# Altium schematic sheet fat51ud.SchDoc
size A3
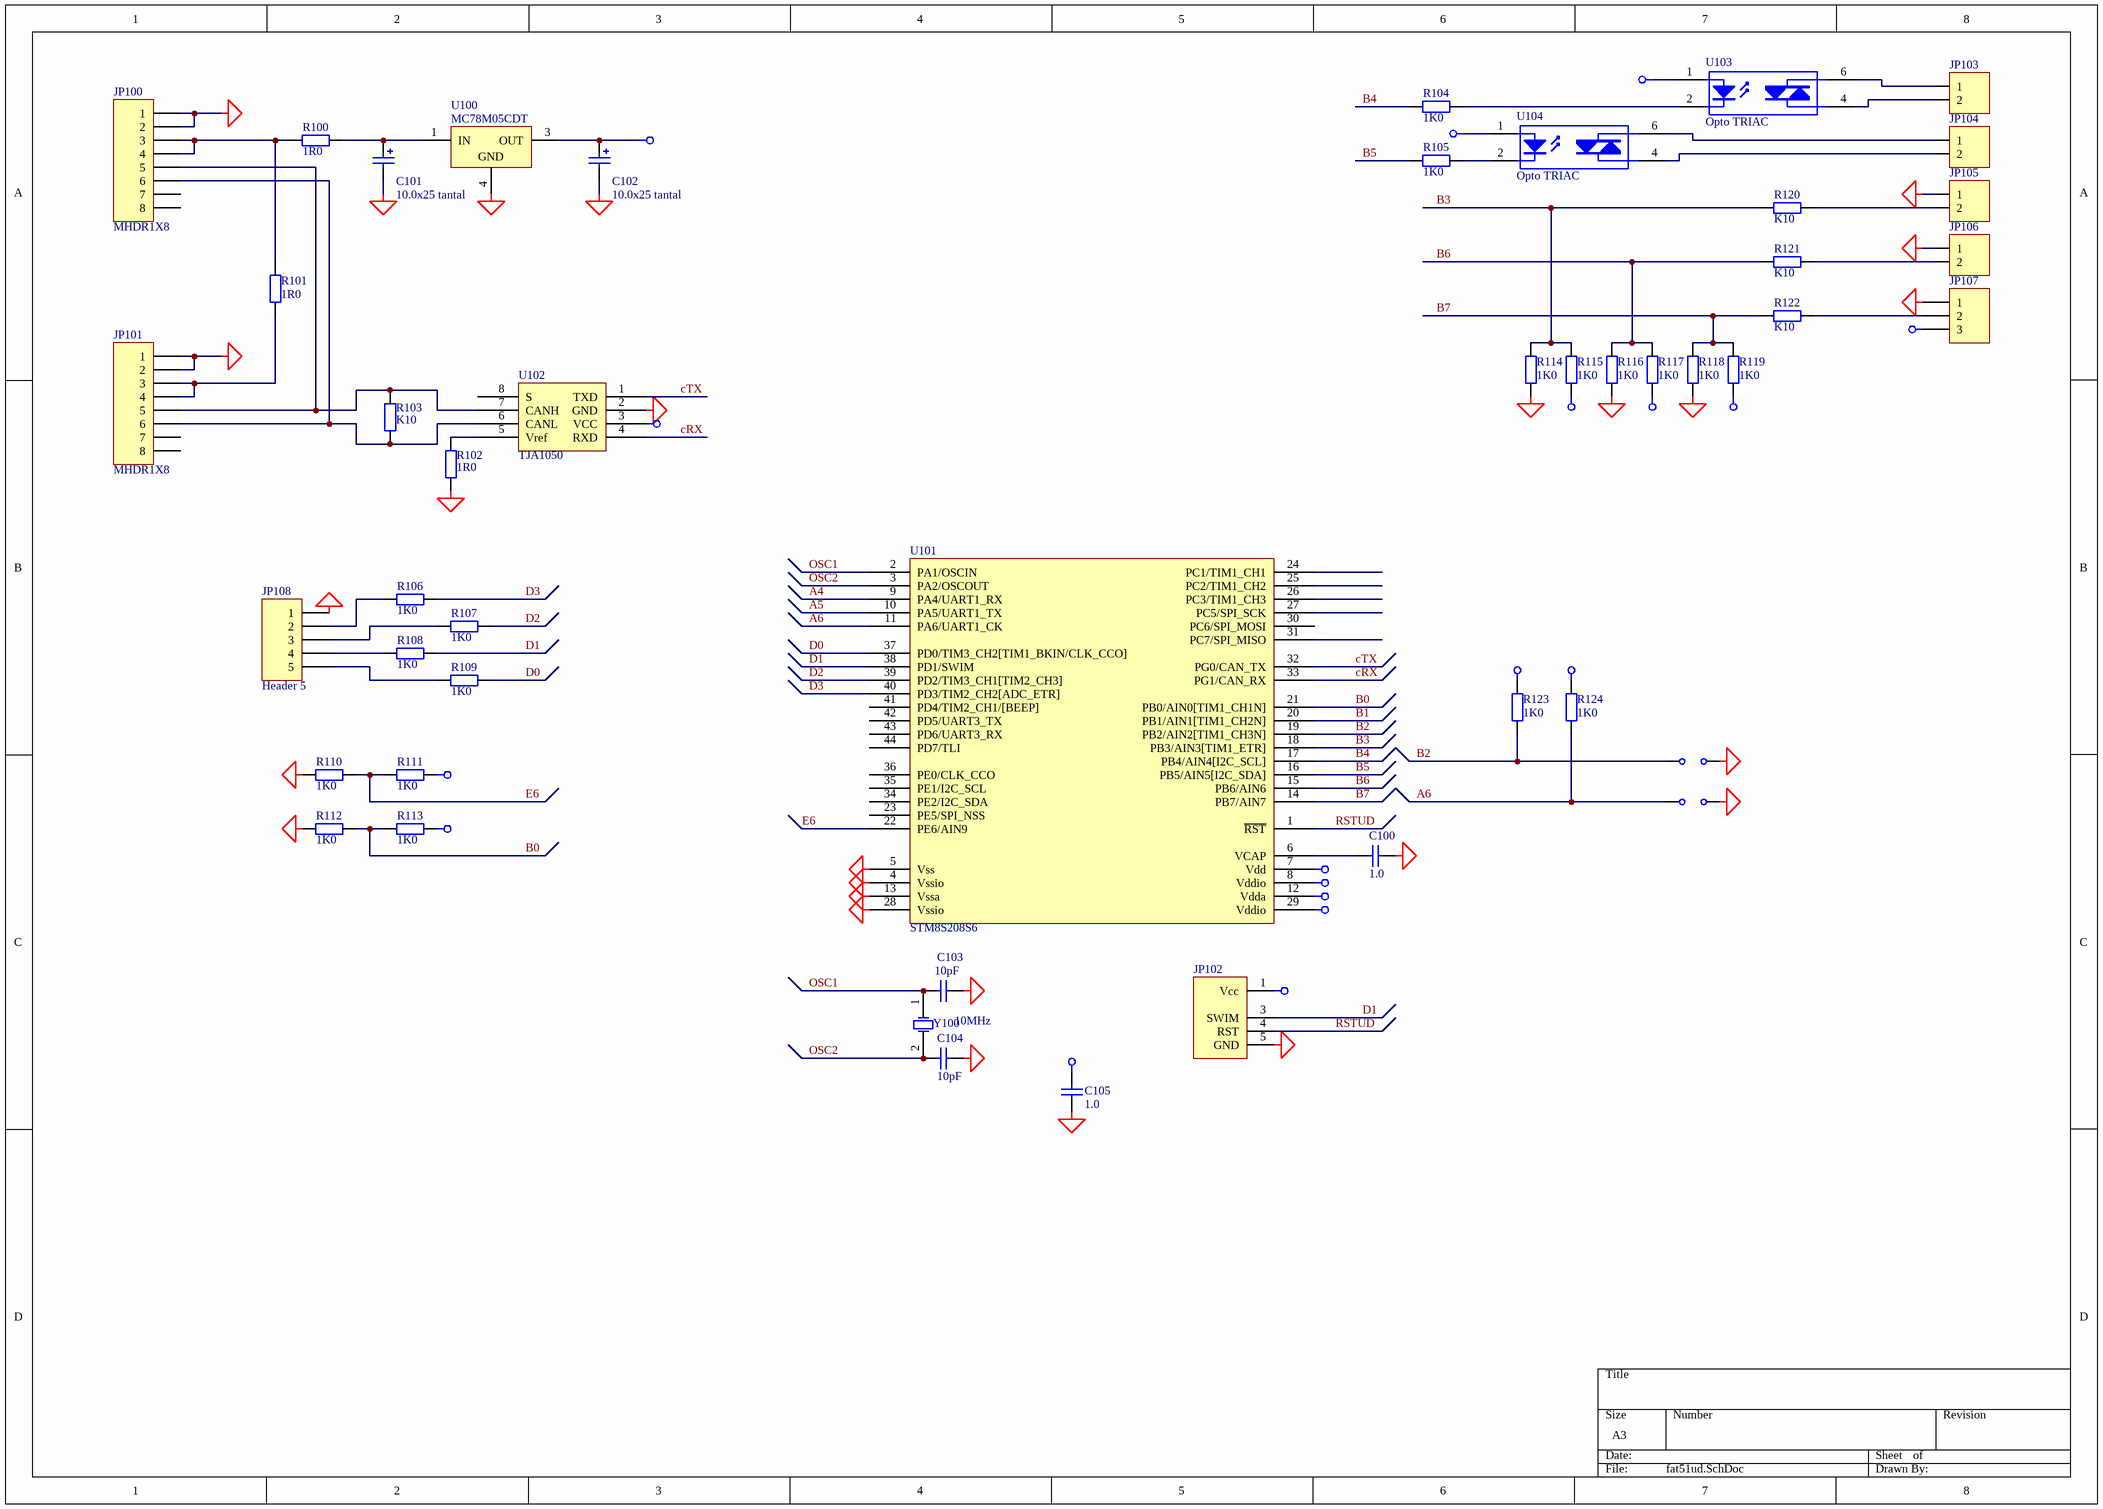
[diagram p0: fat51ud.SchDoc]

## Parts
C100  1.0  [_0805]
C101  10.0x25 tantal  [CAP_EL_6_3]
C102  10.0x25 tantal  [CAP_EL_6_3]
C103  10pF  [_0805]
C104  10pF  [_0805]
C105  1.0  [_0805]
J1  (no value)  [jmp]
J2  (no value)  [jmp]
JP100  MHDR1X8  [8i8p-5306]
JP101  MHDR1X8  [8i8p-5306]
JP102  (no value)  [HDR1X5_uart]
JP103  BT5-2  [BT5-2-1]  (value not drawn)
JP104  BT5-2  [BT5-2-1]  (value not drawn)
JP105  BT5-2  [BT5-2-1]  (value not drawn)
JP106  BT5-2  [BT5-2-1]  (value not drawn)
JP107  Header 3  [BT5-3]  (value not drawn)
JP108  Header 5  [HDR1X5]
R100  1R0  [_0805]
R101  1R0  [_0805]
R102  1R0  [_0805]
R103  K10  [_0805]
R104  1K0  [_0805]
R105  1K0  [_0805]
R106  1K0  [_0805]
R107  1K0  [_0805]
R108  1K0  [_0805]
R109  1K0  [_0805]
R110  1K0  [_0805]
R111  1K0  [_0805]
R112  1K0  [_0805]
R113  1K0  [_0805]
R114  1K0  [_0805]
R115  1K0  [_0805]
R116  1K0  [_0805]
R117  1K0  [_0805]
R118  1K0  [_0805]
R119  1K0  [_0805]
R120  K10  [_0805]
R121  K10  [_0805]
R122  K10  [_0805]
R123  1K0  [_0805]
R124  1K0  [_0805]
U100  MC78M05CDT  [SIP-G3/Z11.05]
U101  STM8S208S6  [QFP10X10-G44/G10N]
U102  TJA1050  [SO-G8/D5]
U103  Opto TRIAC  [dip-6]
U104  Opto TRIAC  [dip-6]
Y100  10MHz  [QWARZ1]

## Nets
+5v_ud: C102.1 C105.1 JP102.1(Vcc) JP107.3 R111.1 R113.1 R115.2 R117.2 R119.2 R123.1 R124.1 U100.3(OUT) U101.7(Vdd) U101.8(Vddio) U101.12(Vdda) U101.29(Vddio) U102.3(VCC) U103.1(A) U104.1(A)
GNDUD: C100.1 C101.2 C102.2 C103.1 C104.1 C105.2 J1.1 J2.1 JP100.1 JP100.2 JP101.1 JP101.2 JP102.5(GND) JP105.1 JP106.1 JP107.1 JP108.1 R102.1 R110.2 R112.2 R114.2 R116.2 R118.2 U100.4(GND) U101.4(Vssio) U101.13(Vssa) U101.28(Vssio) U102.2(GND)
UD: U101.5(Vss)
A4: U101.9(PA4/UART1_RX)
A5: U101.10(PA5/UART1_TX)
A6: J1.2 R124.2 U101.11(PA6/UART1_CK)
B0: R112.1 R113.2 U101.21(PB0/AIN0[TIM1_CH1N])
B1: U101.20(PB1/AIN1[TIM1_CH2N])
B2: J2.2 R123.2 U101.19(PB2/AIN2[TIM1_CH3N])
B3: R114.1 R115.1 R120.2 U101.18(PB3/AIN3[TIM1_ETR])
B4: R104.2 U101.17(PB4/AIN4[I2C_SCL])
B5: R105.2 U101.16(PB5/AIN5[I2C_SDA])
B6: R116.1 R117.1 R121.2 U101.15(PB6/AIN6)
B7: R118.1 R119.1 R122.2 U101.14(PB7/AIN7)
cRX: U101.33(PG1/CAN_RX) U102.4(RXD)
cTX: U101.32(PG0/CAN_TX) U102.1(TXD)
D0: R109.1 U101.37(PD0/TIM3_CH2[TIM1_BKIN/CLK_CCO])
D1: JP102.3(SWIM) R108.1 U101.38(PD1/SWIM)
D2: R107.1 U101.39(PD2/TIM3_CH1[TIM2_CH3])
D3: R106.1 U101.40(PD3/TIM2_CH2[ADC_ETR])
E6: R110.1 R111.2 U101.22(PE6/AIN9)
OSC1: C103.2 U101.2(PA1/OSCIN) Y100.1(OSC1)
OSC2: C104.2 U101.3(PA2/OSCOUT) Y100.2(OSC2)
RSTUD: JP102.4(RST) U101.1(~{RST})
NetC100_2: C100.2 U101.6(VCAP)
NetC101_1: C101.1 R100.2 U100.1(IN)
NetJP100_3: JP100.3 JP100.4 R100.1 R101.2
NetJP100_5: JP100.5 JP101.5 R103.2 U102.7(CANH)
NetJP100_6: JP100.6 JP101.6 R103.1 U102.6(CANL)
NetJP101_3: JP101.3 JP101.4 R101.1
NetJP103_1: JP103.1 U103.6(A/K)
NetJP103_2: JP103.2 U103.4(A/K)
NetJP104_1: JP104.1 U104.6(A/K)
NetJP104_2: JP104.2 U104.4(A/K)
NetJP105_2: JP105.2 R120.1
NetJP106_2: JP106.2 R121.1
NetJP107_2: JP107.2 R122.1
NetJP108_2: JP108.2 R106.2
NetJP108_3: JP108.3 R107.2
NetJP108_4: JP108.4 R108.2
NetJP108_5: JP108.5 R109.2
NetR102_2: R102.2 U102.5(Vref)
NetR104_1: R104.1 U103.2(K)
NetR105_1: R105.1 U104.2(K)

Not connected (* = marked no-connect by the designer): JP100 7 8; JP101 7 8; U101 23(PE5/SPI_NSS) 24(PC1/TIM1_CH1) 25(PC2/TIM1_CH2) 26(PC3/TIM1_CH3) 27(PC5/SPI_SCK) 30(PC6/SPI_MOSI) 31(PC7/SPI_MISO) 34(PE2/I2C_SDA) 35(PE1/I2C_SCL) 36(PE0/CLK_CCO) 41(PD4/TIM2_CH1/[BEEP]) 42(PD5/UART3_TX) 43(PD6/UART3_RX) 44(PD7/TLI); U102 8(S)

## Library data of the parts
C100 C105 = Cap Semi: Capacitor (Semiconductor SIM Model); Manufacturer: Generic Components; Class I: Passive; Value: 1,0; Published: 8-Jun-2000; Revision: July-2002: Re-released for DXP Platform.; Publisher: Altium Limited; Class II: Capacitor
C101 C102 = Cap Pol1: Polarized Capacitor (Radial); Manufacturer: Generic Components; Class I: Passive; Value: 10,0x25; Published: 8-Jun-2000; Revision: July-2002: Re-released for DXP Platform.; Publisher: Altium Limited; Class II: Capacitor
C103 C104 = Cap Semi: Capacitor (Semiconductor SIM Model); Manufacturer: Generic Components; Class I: Passive; Value: 15pF; Published: 8-Jun-2000; Revision: July-2002: Re-released for DXP Platform.; Publisher: Altium Limited; Class II: Capacitor
J1 J2 = JMP: Switch; Manufacturer: Generic Components; Published: 24-Mar-1999; Revision: July-2002: Re-released for DXP Platform.; Publisher: Altium Limited
JP100 JP101 = MHDR1X8: Header, 8-Pin; Manufacturer: Generic Components; Class I: Connector; Revision: July-2002: Re-released for DXP Platform.; Publisher: Altium Limited
JP102 = SWIM_CONN
JP103-JP106 = BT5-2: Header, 3-Pin; Manufacturer: Generic Components; Class I: Connector; Revision: July-2002: Re-released for DXP Platform.; Publisher: Altium Limited
JP107 = Header 3: Header, 3-Pin; Manufacturer: Generic Components; Class I: Connector; Revision: July-2002: Re-released for DXP Platform.; Publisher: Altium Limited
JP108 = Header 5: Header, 5-Pin; Manufacturer: Generic Components; Class I: Connector; Revision: July-2002: Re-released for DXP Platform.; Publisher: Altium Limited
R100 R101 R104-R119 R123 R124 = Res2: Resistor; Manufacturer: Generic Components; Class I: Passive; Value: 1K; Published: 8-Jun-2000; Revision: July-2002: Re-released for DXP Platform.; Publisher: Altium Limited; Class II: Resistor
R102 R103 R120-R122 = Res2: Resistor; Manufacturer: Generic Components; Class I: Passive; Value: 120; Published: 8-Jun-2000; Revision: July-2002: Re-released for DXP Platform.; Publisher: Altium Limited; Class II: Resistor
U100 = MC78M05CDT: Three-Terminal Medium Current Positive Voltage Regulator; Manufacturer: ON Semiconductor; Package Information: Latest Revision: 1997; Class I: Power Management; Note: Pin 2 is electrically connected to Pin 4; Pin 2 is trimmed and not drawn;; Published: 15-Apr-2002; Datasheet: Latest Revision: Apr-2000; Package Reference: 369A-13; Publisher: Altium Limited; Class II: Voltage Regulator
U103 U104 = Opto TRIAC: Opto-Triac; Manufacturer: Generic Components; Class I: Optoelectronic; Published: 24-Mar-1999; Revision: July-2002: Re-released for DXP Platform.; Publisher: Altium Limited
Y100 = XTAL: Crystal Oscillator; Manufacturer: Generic Components; Published: 8-Jun-2000; Revision: July-2002: Re-released for DXP Platform.; Publisher: Altium Limited; Class I: Oscillator; Class II: Crystal Oscillator; Value: 10MHz